# EAGLE design forever flasher (EAGLE 6.1)
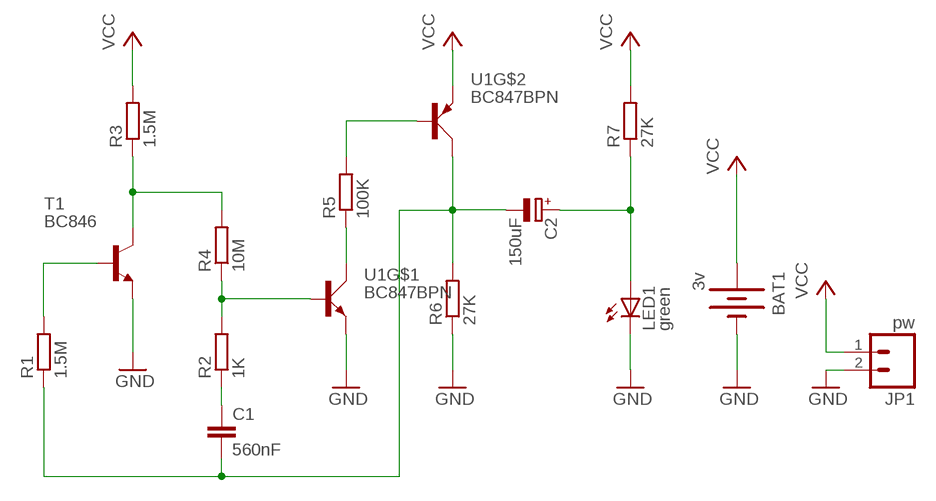
[diagram p0: schematic, sheet 1]

## Parts
BAT1  3v  BATTERY12MM  [BATTCON_12MM]
C1  560nF  C-EUC0805  [C0805]
C2  150uF  CPOL-EUCT7343  [CT7343]
JP1  pw  M02PTH  [1X02]
LED1  green  LEDCHIPLED_0805  [CHIPLED_0805]
R1  1.5M  R-EU_R0805  [R0805]
R2  1K  R-EU_R0805  [R0805]
R3  1.5M  R-EU_R0805  [R0805]
R4  10M  R-EU_R0805  [R0805]
R5  100K  R-EU_R0805  [R0805]
R6  27K  R-EU_R0805  [R0805]
R7  27K  R-EU_R0805  [R0805]
T1  BC846  [SOT23]
U1  BC847BPN  BC847BPN"  [SOT363_PHILIPS]

## Nets
GND: BAT1.GND(-) JP1.2 LED1.C R6.1 T1.2(E) U1.1(E)
N$1: R1.2 T1.1(B)
N$2: R3.1 R4.2 T1.3(C)
N$3: C1.2 C2.- R1.1 R6.2 U1.3(C)
N$4: C1.1 R2.1
N$5: R2.2 R4.1 U1.2(B)
N$7: R5.2 U1.5(B)
N$8: R5.1 U1.6(C)
N$11: C2.+ LED1.A R7.1
VCC: BAT1.PWR@1(+) JP1.1 R3.2 R7.2 U1.4(E)

## Library data of the parts
BAT1 = SparkFun:BATTERY: Battery Holders Various common sizes : AA, AAA, 20mm coin cell and 12mm coin cell.
C1 = rcl:C-EU: CAPACITOR, European symbol
C2 = rcl:CPOL-EU: POLARIZED CAPACITOR, European symbol
JP1 = SparkFun:M02: Header 2 Standard 2-pin 0.1" header. Use with straight break away headers (SKU : PRT-00116), right angle break away headers (PRT-00553), swiss pins (PRT-00743), machine pins (PRT-00117), and female headers (PRT-00115). Molex polarized connector foot print use with SKU : PRT-08233 with associated crimp pins and housings.
LED1 = led:LED: LED OSRAM: - CHIPLED LG R971, LG N971, LY N971, LG Q971, LY Q971, LO R971, LY R971 LH N974, LH R974 LS Q976, LO Q976, LY Q976 LO Q996 - Hyper CHIPLED LW Q18S LB Q993, LB Q99A, LB R99A - SideLED LS A670, LO A670, LY A670, LG A670, LP A670 LB A673, LV A673, LT A673, LW A673 LH A674 LY A675 LS A676, LA A676, LO A676, LY A676, LW A676 LS A679, LY A679, LG A679 - Hyper Micro SIDELED® LS Y876, LA Y876, LO Y876, LY Y876 LT Y87S - SmartLED LW L88C, LW L88S LB L89C, LB L89S, LG L890 LS L89K, LO L89K, LY L89K LS L896, LA L896, LO L896, LY L896 - TOPLED LS T670, LO T670, LY T670, LG T670, LP T670 LSG T670, LSP T670, LSY T670, LOP T670, LYG T670 LG T671, LOG T671, LSG T671 LB T673, LV T673, LT T673, LW T673 LH T674 LS T676, LA T676, LO T676, LY T676, LB T676, LH T676, LSB T676, LW T676 LB T67C, LV T67C, LT T67C, LS T67K, LO T67K, LY T67K, LW E67C LS E67B, LA E67B, LO E67B, LY E67B, LB E67C, LV E67C, LT E67C LW T67C LS T679, LY T679, LG T679 LS T770, LO T770, LY T770, LG T770, LP T770 LB T773, LV T773, LT T773, LW T773 LH T774 LS E675, LA E675, LY E675, LS T675 LS T776, LA T776, LO T776, LY T776, LB T776 LHGB T686 LT T68C, LB T68C - Hyper Mini TOPLED® LB M676 - Mini TOPLED Santana® LG M470 LS M47K, LO M47K, LY M47K Source: http://www.osram.convergy.de LUXEON: - LUMILED® LXK2-PW12-R00, LXK2-PW12-S00, LXK2-PW14-U00, LXK2-PW14-V00 LXK2-PM12-R00, LXK2-PM12-S00, LXK2-PM14-U00 LXK2-PE12-Q00, LXK2-PE12-R00, LXK2-PE12-S00, LXK2-PE14-T00, LXK2-PE14-U00 LXK2-PB12-K00, LXK2-PB12-L00, LXK2-PB12-M00, LXK2-PB14-N00, LXK2-PB14-P00, LXK2-PB14-Q00 LXK2-PR12-L00, LXK2-PR12-M00, LXK2-PR14-Q00, LXK2-PR14-R00 LXK2-PD12-Q00, LXK2-PD12-R00, LXK2-PD12-S00 LXK2-PH12-R00, LXK2-PH12-S00 LXK2-PL12-P00, LXK2-PL12-Q00, LXK2-PL12-R00 Source: www.luxeon.com KINGBRIGHT: KA-3528ASYC Source: www.kingbright.com
R1-R7 = rcl:R-EU_: RESISTOR, European symbol
T1 = transistor:BC846: NPN TRANSISTOR
U1 = bc847bpn:BC847BPN: NPN/PNP general-purpose transistor pair 45 V, 100 mA

## Board
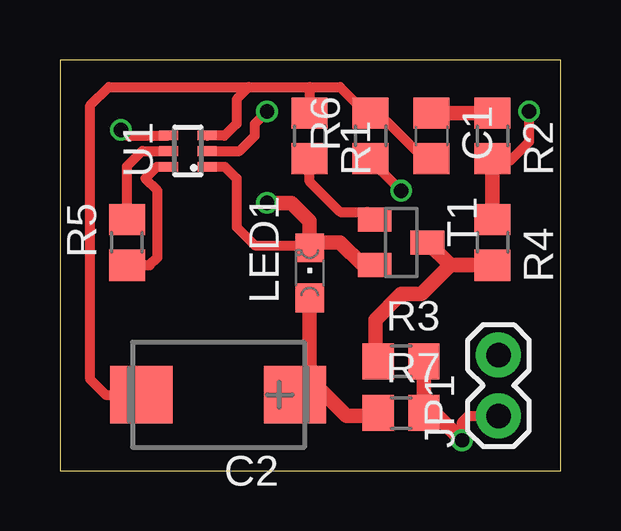
[diagram p1: board, top side]
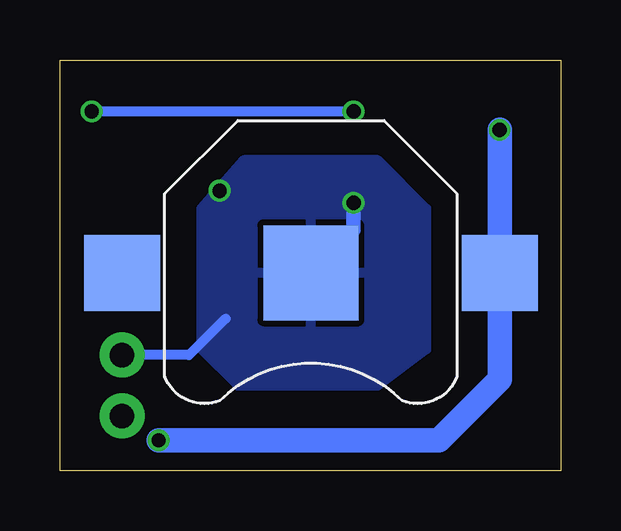
[diagram p2: board, bottom side, seen from below]

Size 20.88 x 17.14 mm. Coordinates in mm from the lower left corner, seen from the top.
Outline: 0,0 20.88,0 20.88,17.14 0,17.14 0,0
Copper layers (1*16): Top 0.035mm / dielectric 1.5mm / Bottom 0.035mm
Design rules: minimum track width 6mil, minimum drill 12mil, track to track 6mil, track to pad 6mil, pad to pad 6mil, via to via 6mil, smd to smd 0mil, copper to edge 10mil, drill to drill 10mil, minimum pad ring 10mil, minimum via ring 6mil, stop-mask expansion 2mil, vias tented up to drill 100mil, thermal gap 10mil

### Footprints (pad centres in the part's own frame; a part is rotated, then mirrored left to right if it is on the bottom)
BATTCON_12MM = smd 3.962 x 3.962: GND 0,0 | smd 3.175 x 3.175: PWR@1 -7.874,0; PWR@2 7.874,0
C0805 = smd 1.3 x 1.5: 1 -0.95,0; 2 0.95,0
CT7343 = smd 2.6 x 2.4: + -3.2,0; - 3.2,0
1X02 = drill 1.016 pad 1.88: 1 0,0; 2 2.54,0
CHIPLED_0805 = smd 1.2 x 1.2: A 0,-1.05; C 0,1.05
R0805 = smd 1.3 x 1.5: 1 -0.95,0; 2 0.95,0
SOT23 = smd 1 x 1.4: 1 -0.95,-1.1; 2 0.95,-1.1; 3 0,1.1
SOT363_PHILIPS = smd 0.4 x 0.8: 1 -0.65,-0.8; 2 0,-0.8; 3 0.65,-0.8; 4 0.65,0.8; 5 0,0.8; 6 -0.65,0.8

### Placement (x,y rotation side)
BAT1  10.41,8.26 180 bottom
C1  15.49,13.97 270 top
C2  6.6,3.17 180 top
JP1  18.29,2.29 90 top
LED1  10.41,8.26 0 top
R1  10.41,13.97 270 top
R2  18.03,13.97 270 top
R3  14.22,4.57 0 top
R4  18.03,9.53 270 top
R5  2.79,9.53 90 top
R6  12.95,13.97 90 top
R7  14.22,2.41 0 top
T1  14.22,9.53 270 top
U1  5.33,13.34 90 top

### Tracks (layer width: path | path; a pad name or v marks a point on that pad's centre or on a via)
GND  (via drill 0.6)
  Top 0.406: 10.32,9.4 10.19,9.53 | U1.1 6.87,12.69 7.37,12.19 7.37,10.16 8.13,9.4 10.32,9.4 | 10.32,9.4 LED1.C | R6.1 12.95,12.95 v14.22,11.68
  Top 0.61: T1.2 12.63,8.57 11.68,9.53 10.63,9.53 LED1.C 10.41,10.41 9.65,11.18 v8.64,11.18 | 10.32,9.4 10.32,9.49
  Bottom 0.406: JP1.2 15.49,4.83 13.97,6.35
  Bottom 0.61: v8.64,11.18 8.64,10.03 BAT1.GND
  pour Bottom (isolate 0.61): 5.59,5.08 5.59,10.92 7.62,12.95 13.21,12.95 14.99,10.92 14.99,5.08 13.46,3.56 7.62,3.56
N$1
  Top 0.406: 10.41,12.7 10.41,12.06 11.68,10.79 12.8,10.79 T1.1
  Top 0.61: T1.1 13.12,10.62 | 10.41,12.7 R1.2
N$2
  Top 0.61: 16.27,8.57 T1.3 | 16.27,8.57 R4.2 | 16.27,8.57 15.06,7.37 14.22,7.37 13.15,6.29 13.15,5.33 R3.1
N$3
  Top 0.406: 7.87,16 10.41,16 | 7.87,16 7.37,15.49 7.37,14.48 6.86,13.97 6.15,13.97 U1.3 | C2.- 1.91,3.17 1.27,3.81 1.27,15.24 2.03,16 7.87,16 | 10.41,16 R1.1 | 10.41,16 11.68,16 12.77,14.92 R6.2 13.27,14.92 14.99,13.21 15.31,13.21 C1.2
N$4
  Top 0.61: C1.1 R2.1
N$5  (via drill 0.6)
  Top 0.406: 5.97,13.34 U1.2 7.49,13.34 8.13,13.97 8.13,14.48 v8.64,14.99 | 18.03,13.34 R2.2 18.1,12.95 18.8,12.95 19.56,13.72 v19.56,14.99
  Top 0.61: R2.2 R4.1
  Bottom 0.406: v8.64,14.99 v19.56,14.99
N$7
  Top 0.406: U1.5 3.43,13.34 2.79,12.7 R5.2
N$8
  Top 0.406: U1.6 4.05,12.69 3.56,12.19 4.06,11.68 4.06,8.89 3.75,8.57 R5.1
N$11
  Top 0.61: 10.41,3.79 LED1.A | C2.+ 10.41,3.79 | 10.41,3.79 10.44,3.79 11.94,2.29 13.15,2.29 R7.1
VCC  (via drill 0.6)
  Top 0.406: U1.4 2.78,13.98 v2.54,14.22 | v16.76,1.27 16.76,2.03 17.02,2.29 JP1.1
  Top 0.61: R3.2 R7.2 15.62,2.41 v16.76,1.27
  Bottom 1.016: v2.54,14.22 BAT1.PWR@1 2.54,3.81 5.08,1.27 v16.76,1.27

### Text on the board
bDocu: - | 1,5-3V | peter 2011 | +